# Altium schematic sheet Main.SchDoc
size A3; Date: 04.01.2021; Organization: Altium Limited; Address1: L3, 12a Rodborough Rd; Address2: Frenchs Forest; Address3: NSW; Address4: Australia 2086; SheetNumber: 1; SheetTotal: 3; Version: 1; Название устройства: Main
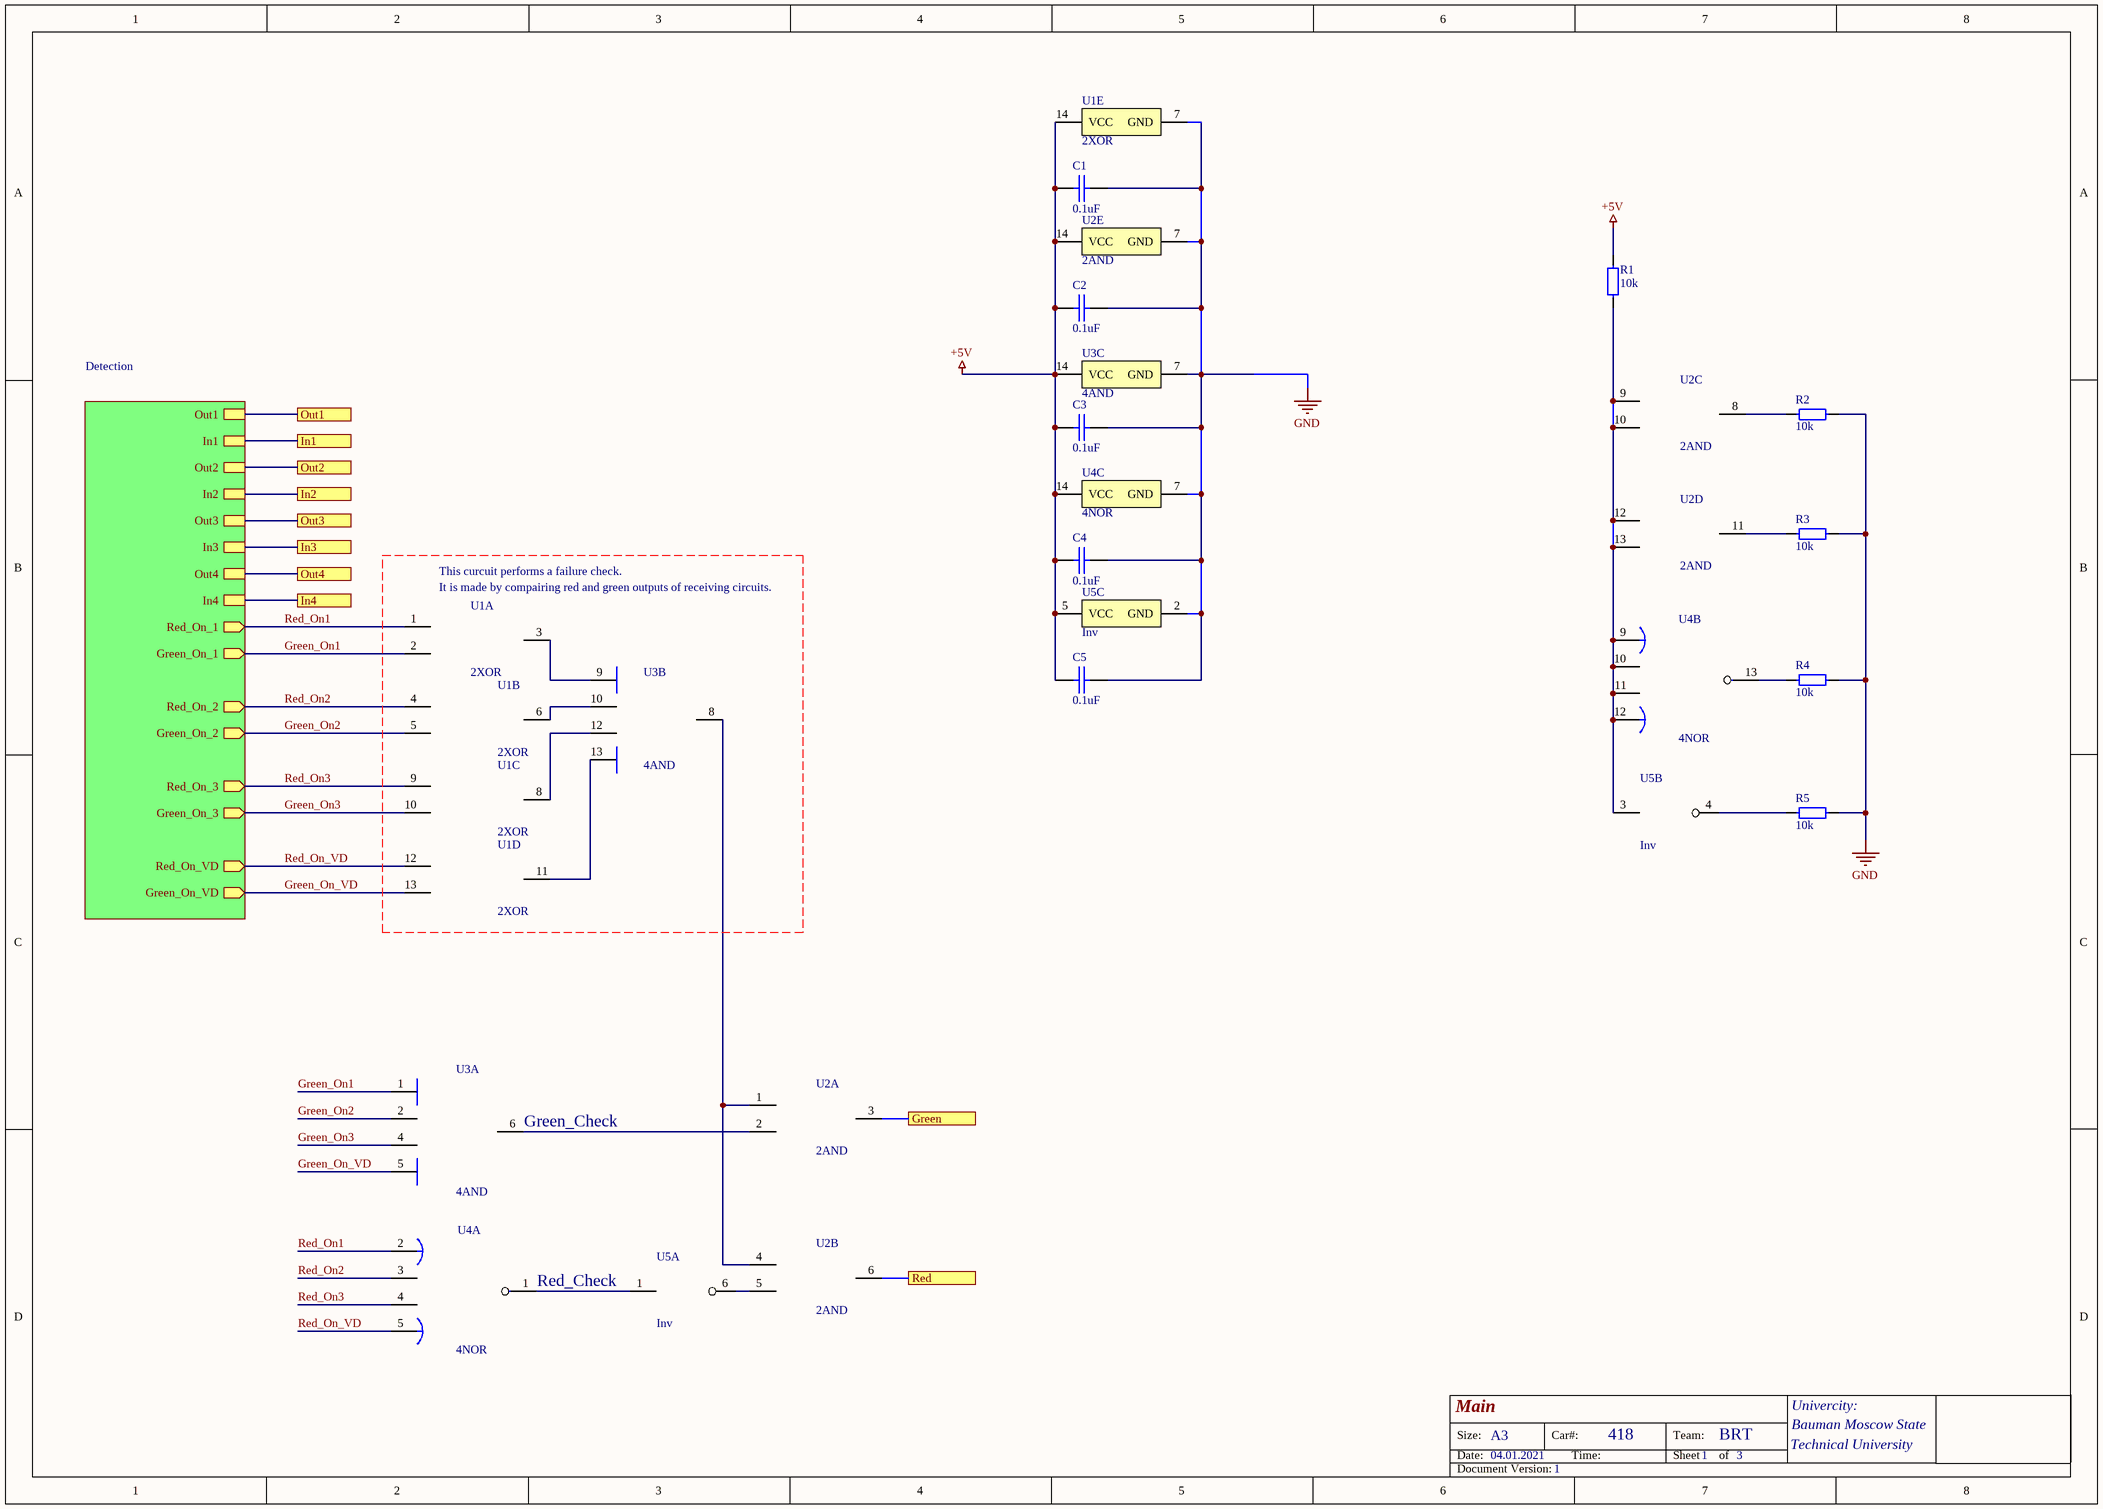
[diagram p0: Main.SchDoc]

## Parts
C1  0.1uF  [0603 Capicator]
C2  0.1uF  [0603 Capicator]
C3  0.1uF  [0603 Capicator]
C4  0.1uF  [0603 Capicator]
C5  0.1uF  [0603 Capicator]
R1  10k  [0603 Resistor]
R2  10k  [0603 Resistor]
R3  10k  [0603 Resistor]
R4  10k  [0603 Resistor]
R5  10k  [0603 Resistor]
U1  2XOR  [SOIC-14]  (parts A,B,C,D,E of 5)
U2  2AND  [SOIC-14]  (parts A,B,C,D,E of 5)
U3  4AND  [SOIC-14]  (parts A,B,C of 3)
U4  4NOR  [SOIC-14]  (parts A,B,C of 3)
U5  Inv  [SOT236]  (parts A,B,C of 3)

## Sub-sheets
Detection = DetectionPart.SchDoc: Green_On_2 (out), Red_On_1 (out), Red_On_VD (out), Green_On_VD (out), Red_On_2 (out), Green_On_3 (out), Red_On_3 (out), Green_On_1 (out), Out4, Out3, Out1, In3, In2, Out2, In1, In4

## Ports
Green, In1, In2, In3, In4, Out1, Out2, Out3, Out4, Red

## Nets
+5V: C1.2 C2.2 C3.2 C4.2 C5.2 R1.2 U1.14(VCC) U2.14(VCC) U3.14(VCC) U4.14(VCC) U5.5(VCC)
GND: C1.1 C2.1 C3.1 C4.1 C5.1 R2.1 R3.1 R4.1 R5.1 U1.7(GND) U2.7(GND) U3.7(GND) U4.7(GND) U5.2(GND)
Green: U2.3(1Y) ; port Green
Green_On1: U1.2(B) U3.1(A) ; sheet Detection/Green_On_1
Green_On2: U1.5(B) U3.2(B) ; sheet Detection/Green_On_2
Green_On3: U1.10(B) U3.4(C) ; sheet Detection/Green_On_3
Green_On_VD: U1.13(B) U3.5(D) ; sheet Detection/Green_On_VD
In1: port In1, sheet Detection/In1
In2: port In2, sheet Detection/In2
In3: port In3, sheet Detection/In3
In4: port In4, sheet Detection/In4
Out1: port Out1, sheet Detection/Out1
Out2: port Out2, sheet Detection/Out2
Out3: port Out3, sheet Detection/Out3
Out4: port Out4, sheet Detection/Out4
Red: U2.6(2Y) ; port Red
Red_On1: U1.1(A) U4.2(A) ; sheet Detection/Red_On_1
Red_On2: U1.4(A) U4.3(B) ; sheet Detection/Red_On_2
Red_On3: U1.9(A) U4.4(C) ; sheet Detection/Red_On_3
Red_On_VD: U1.12(A) U4.5(D) ; sheet Detection/Red_On_VD
NetR1_1: R1.1 U2.9(3A) U2.10(3B) U2.12(4A) U2.13(4B) U4.9(A) U4.10(B) U4.11(C) U4.12(D) U5.3(2А)
NetR2_2: R2.2 U2.8(3Y)
NetR3_2: R3.2 U2.11(4Y)
NetR4_2: R4.2 U4.13(Y)
NetR5_2: R5.2 U5.4(2Y)
NetU1_3: U1.3(Y) U3.9(A)
NetU1_6: U1.6(Y) U3.10(B)
NetU1_8: U1.8(Y) U3.12(C)
NetU1_11: U1.11(Y) U3.13(D)
NetU2_1: U2.1(1A) U2.4(2A) U3.8(Y)
NetU2_2: U2.2(1B) U3.6(Y)
NetU2_5: U2.5(2B) U5.6(1Y)
NetU4_1: U4.1(Y) U5.1(1A)

## Notes on the sheet
- (near U1) This curcuit performs a failure check.
- (near U1) It is made by compairing red and green outputs of receiving circuits.
- (near U3) Green_Check
- Red_Check
- Size:
- Date:
- A3
- Car#:
- Time:
- 418
- Team:
- Sheet
- BRT
- of
- Technical University
- Univercity:
- Bauman Moscow State
- Document Version:

## Library data of the parts
C1-C5 = Cap 0.1uF (0603): 0.1uF X7R 16V 10% 0603; Manufacturer: Murata Manufacturing; Part Number: GRM188R71C104KA01D; Type: Capacitor; ComponentLink1Description: Chip&Dip; ComponentLink1URL: https://www.chipdip.ru/product/grm188r71c104ka01d
R1-R5 = Res 10k (0603): 0.1W 0603 10k, 1%; Part Number: RC0603FR-0710KL; Manufacturer: Taiwan; Type: Resistor; ComponentLink1Description: Chip&Dip; ComponentLink1URL: https://www.chipdip.ru/product0/9000079736
U1 = 4(2XOR): 4 logic elements "2XOR"; Part Number: 74HC86D,653; Manufacturer: Nexperia; ComponentLink1Description: Chip&Dip; ComponentLink1URL: https://www.chipdip.ru/product/74hc86d; Type: IC; ComponentLink2Description: DataSheet; ComponentLink2URL: https://ru.mouser.com/datasheet/2/916/74HC_HCT86-1319799.pdf
U2 = 2And: 4 logic elements "2AND"; Part Number: SN74AC08DR; Manufacturer: Texas Instruments; ComponentLink1Description: DataSheet; ComponentLink1URL: https://static.chipdip.ru/lib/551/DOC001551527.pdf; ComponentLink2Description: Chip&Dip; ComponentLink2URL: https://www.chipdip.ru/product/sn74ac08dr; Type: IC
U3 = 2(4AND): 2 logic elements "4AND"; Part Number: 74HC21D,653; Manufacturer: Nexperia; ComponentLink1Description: Chip&Dip; ComponentLink1URL: https://www.chipdip.ru/product/74hc21d.653; Type: IC; ComponentLink2Description: DataSheet; ComponentLink2URL: https://static.chipdip.ru/lib/522/DOC011522559.pdf
U4 = 2(4NOR): 2 logic elements "4NOR"; Part Number: 74HC4002D,652; Manufacturer: Nexperia; ComponentLink1Description: Chip&Dip; ComponentLink1URL: https://www.chipdip.ru/product/74hc4002d; Type: IC; ComponentLink2Description: DataSheet; ComponentLink2URL: https://static.chipdip.ru/lib/493/DOC011493188.pdf
U5 = Inverter (SN74): Dual inverter, 1.65-5.5V; Manufacturer: Texas Instruments; Part Number: SN74LVC2G04DBVR; ComponentLink1Description: Chip&Dip; ComponentLink1URL: https://www.chipdip.ru/product/sn74lvc2g04dbvr-2; ComponentLink2Description: DataSheet; ComponentLink2URL: https://static.chipdip.ru/lib/021/DOC001021810.pdf; Type: IC